# EAGLE design SD (EAGLE 6.4)
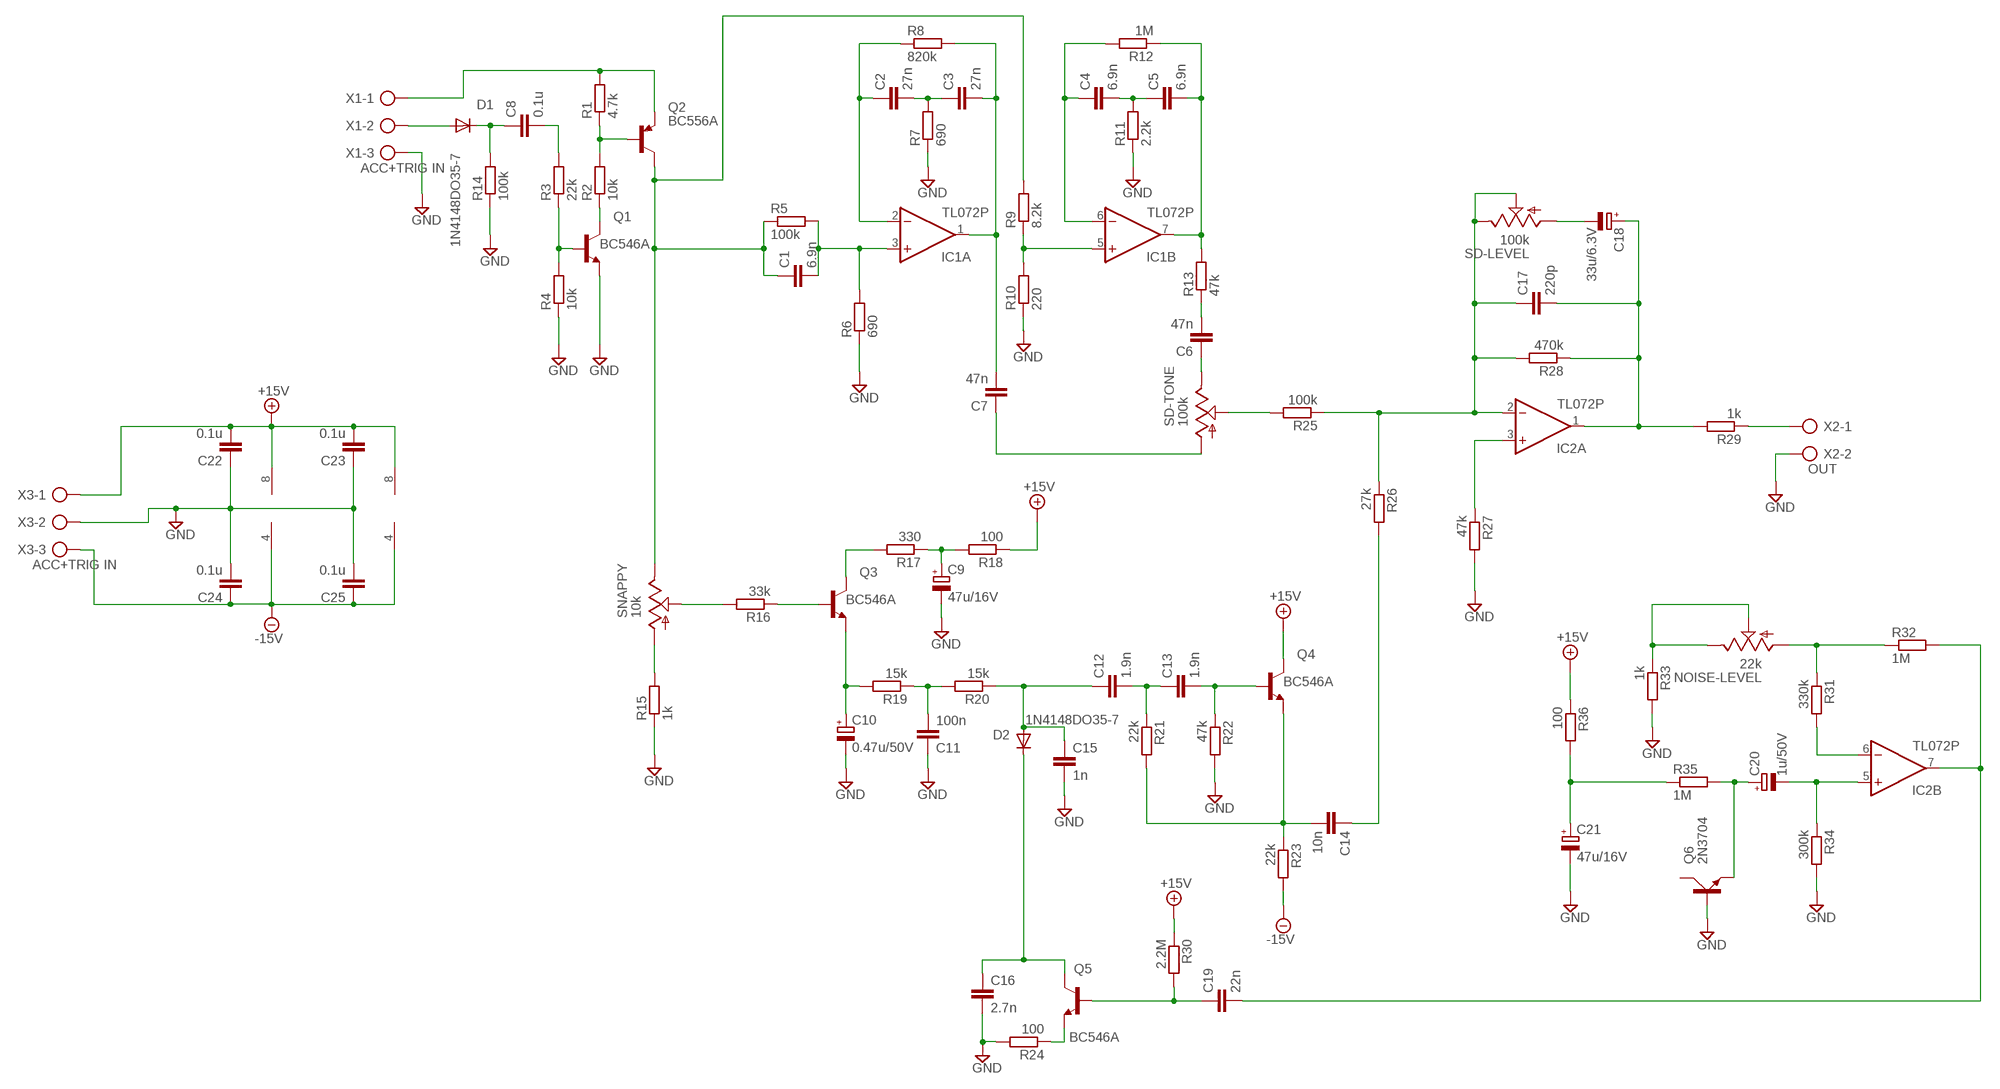
[diagram p0: schematic, sheet 1]

## Parts
C1  6.9n  C-EU075-042X103  [C075-042X103]
C2  27n  C-EU075-042X103  [C075-042X103]
C3  27n  C-EU075-042X103  [C075-042X103]
C4  6.9n  C-EU075-042X103  [C075-042X103]
C5  6.9n  C-EU075-042X103  [C075-042X103]
C6  47n  C-EU075-042X103  [C075-042X103]
C7  47n  C-EU075-042X103  [C075-042X103]
C8  0.1u  C-EU075-042X103  [C075-042X103]
C9  47u/16V  CPOL-EUE2-5  [E2-5]
C10  0.47u/50V  CPOL-EUE2-5  [E2-5]
C11  100n  C-EU075-042X103  [C075-042X103]
C12  1.9n  C-EU075-042X103  [C075-042X103]
C13  1.9n  C-EU075-042X103  [C075-042X103]
C14  10n  C-EU075-042X103  [C075-042X103]
C15  1n  C-EU075-042X103  [C075-042X103]
C16  2.7n  C-EU075-042X103  [C075-042X103]
C17  220p  C-EU075-042X103  [C075-042X103]
C18  33u/6.3V  CPOL-EUE2-5  [E2-5]
C19  22n  C-EU075-042X103  [C075-042X103]
C20  1u/50V  CPOL-EUE2-5  [E2-5]
C21  47u/16V  CPOL-EUE2-5  [E2-5]
C22  0.1u  C-EU075-042X103  [C075-042X103]
C23  0.1u  C-EU075-042X103  [C075-042X103]
C24  0.1u  C-EU075-042X103  [C075-042X103]
C25  0.1u  C-EU075-042X103  [C075-042X103]
D1  1N4148DO35-7  [DO35-7]
D2  1N4148DO35-7  [DO35-7]
IC1  TL072P  [DIL08]
IC2  TL072P  [DIL08]
NOISE-LEVEL  22k  TRIM_US-ECP10P  [ECP10P]
Q1  BC546A  [TO92-EBC]
Q2  BC556A  [TO92-EBC]
Q3  BC546A  [TO92-EBC]
Q4  BC546A  [TO92-EBC]
Q5  BC546A  [TO92-EBC]
Q6  2N3704  [TO92C]
R1  4.7k  R-EU_0207/10  [0207/10]
R2  10k  R-EU_0207/10  [0207/10]
R3  22k  R-EU_0207/10  [0207/10]
R4  10k  R-EU_0207/10  [0207/10]
R5  100k  R-EU_0207/10  [0207/10]
R6  690  R-EU_0207/10  [0207/10]
R7  690  R-EU_0207/10  [0207/10]
R8  820k  R-EU_0207/10  [0207/10]
R9  8.2k  R-EU_0207/10  [0207/10]
R10  220  R-EU_0207/10  [0207/10]
R11  2.2k  R-EU_0207/10  [0207/10]
R12  1M  R-EU_0207/10  [0207/10]
R13  47k  R-EU_0207/10  [0207/10]
R14  100k  R-EU_0207/10  [0207/10]
R15  1k  R-EU_0207/10  [0207/10]
R16  33k  R-EU_0207/10  [0207/10]
R17  330  R-EU_0207/10  [0207/10]
R18  100  R-EU_0207/10  [0207/10]
R19  15k  R-EU_0207/10  [0207/10]
R20  15k  R-EU_0207/10  [0207/10]
R21  22k  R-EU_0207/10  [0207/10]
R22  47k  R-EU_0207/10  [0207/10]
R23  22k  R-EU_0207/10  [0207/10]
R24  100  R-EU_0207/10  [0207/10]
R25  100k  R-EU_0207/10  [0207/10]
R26  27k  R-EU_0207/10  [0207/10]
R27  47k  R-EU_0207/10  [0207/10]
R28  470k  R-EU_0207/10  [0207/10]
R29  1k  R-EU_0207/10  [0207/10]
R30  2.2M  R-EU_0207/10  [0207/10]
R31  330k  R-EU_0207/10  [0207/10]
R32  1M  R-EU_0207/10  [0207/10]
R33  1k  R-EU_0207/10  [0207/10]
R34  300k  R-EU_0207/10  [0207/10]
R35  1M  R-EU_0207/10  [0207/10]
R36  100  R-EU_0207/10  [0207/10]
SD-LEVEL  100k  TRIM_US-ECP10P  [ECP10P]
SD-TONE  100k  TRIM_US-ECP10P  [ECP10P]
SNAPPY  10k  TRIM_US-ECP10P  [ECP10P]
X1  ACC+TRIG IN  AK300/3  [AK300/3]
X2  OUT  AK300/2  [AK300/2]
X3  ACC+TRIG IN  AK300/3  [AK300/3]

## Nets
+15V: C22.2 C23.2 IC1.8(P:V+) IC2.8(P:V+) Q4.C R18.1 R30.1 R36.1 X3.1
-15V: C24.1 C25.1 IC1.4(P:V-) IC2.4(P:V-) R23.2 X3.3
GND: C9.- C10.- C11.1 C15.2 C16.2 C21.- C22.1 C23.1 C24.2 C25.2 Q1.E Q6.B R4.1 R6.1 R7.1 R10.1 R11.1 R14.1 R15.1 R22.2 R24.2 R27.2 R33.2 R34.2 X1.3 X2.2 X3.2
N$1: Q2.E R1.2 X1.1
N$2: Q2.B R1.1 R2.2
N$3: Q1.C R2.1
N$4: C8.2 R3.2
N$5: Q1.B R3.1 R4.2
N$6: C1.2 IC1.3(A:+IN) R5.2 R6.2
N$7: C1.1 Q2.C R5.1 R9.2 SNAPPY.E
N$8: C3.2 C7.2 IC1.1(A:OUT) R8.2
N$9: IC1.5(B:+IN) R9.1 R10.2
N$10: C2.1 IC1.2(A:-IN) R8.1
N$11: C2.2 C3.1 R7.2
N$12: C7.1 SD-TONE.A
N$13: C5.2 IC1.7(B:OUT) R12.1 R13.2
N$14: C4.1 IC1.6(B:-IN) R12.2
N$15: C4.2 C5.1 R11.2
N$16: C6.1 SD-TONE.E
N$17: C6.2 R13.1
N$18: C8.1 D1.C R14.2
N$19: D1.A X1.2
N$20: R15.2 SNAPPY.A
N$21: R16.2 SNAPPY.S
N$22: Q3.B R16.1
N$23: Q3.C R17.2
N$24: C9.+ R17.1 R18.2
N$25: C10.+ Q3.E R19.2
N$26: C11.2 R19.1 R20.2
N$27: C13.2 Q4.B R22.1
N$28: C12.2 C13.1 R21.1
N$29: C12.1 C15.1 D2.A R20.1
N$30: C14.2 Q4.E R21.2 R23.1
N$31: C16.1 D2.C Q5.C
N$32: R25.2 SD-TONE.S
N$33: Q5.E R24.1
N$34: C14.1 R26.2
N$35: C17.1 IC2.2(A:-IN) R25.1 R26.1 R28.2 SD-LEVEL.E SD-LEVEL.S
N$36: IC2.3(A:+IN) R27.1
N$37: R29.1 X2.1
N$38: C19.1 Q5.B R30.2
N$39: C18.- SD-LEVEL.A
N$40: C17.2 C18.+ IC2.1(A:OUT) R28.1 R29.2
N$41: C19.2 IC2.7(B:OUT) R32.2
N$42: NOISE-LEVEL.A R31.1 R32.1
N$43: IC2.6(B:-IN) R31.2
N$44: NOISE-LEVEL.E NOISE-LEVEL.S R33.1
N$45: C20.- IC2.5(B:+IN) R34.1
N$46: C20.+ Q6.E R35.2
N$47: C21.+ R35.1 R36.2
Unconnected: Q6.C

## Library data of the parts
C1-C8 C11-C17 C19 C22-C25 = rcl:C-EU: CAPACITOR, European symbol
C9 C10 C18 C20 C21 = rcl:CPOL-EU: POLARIZED CAPACITOR, European symbol
D1 D2 = diode:1N4148: DIODE high speed (Philips)
IC1 IC2 = linear:TL072: OP AMP
NOISE-LEVEL SD-LEVEL SD-TONE SNAPPY = pot:TRIM_US-: POTENTIOMETER
Q1 Q3-Q5 = transistor-npn:BC546*: NPN Transistor
Q2 = transistor-pnp:BC556*: PNP Transistror
Q6 = transistor-small-signal:2N3704: NPN TRANSISTOR
R1-R36 = rcl:R-EU_: RESISTOR, European symbol
X1 X3 = con-ptr500:AK300/3: CONNECTOR; OC_FARNELL: unknown; OC_NEWARK: unknown
X2 = con-ptr500:AK300/2: CONNECTOR; OC_FARNELL: unknown; OC_NEWARK: unknown

## Board
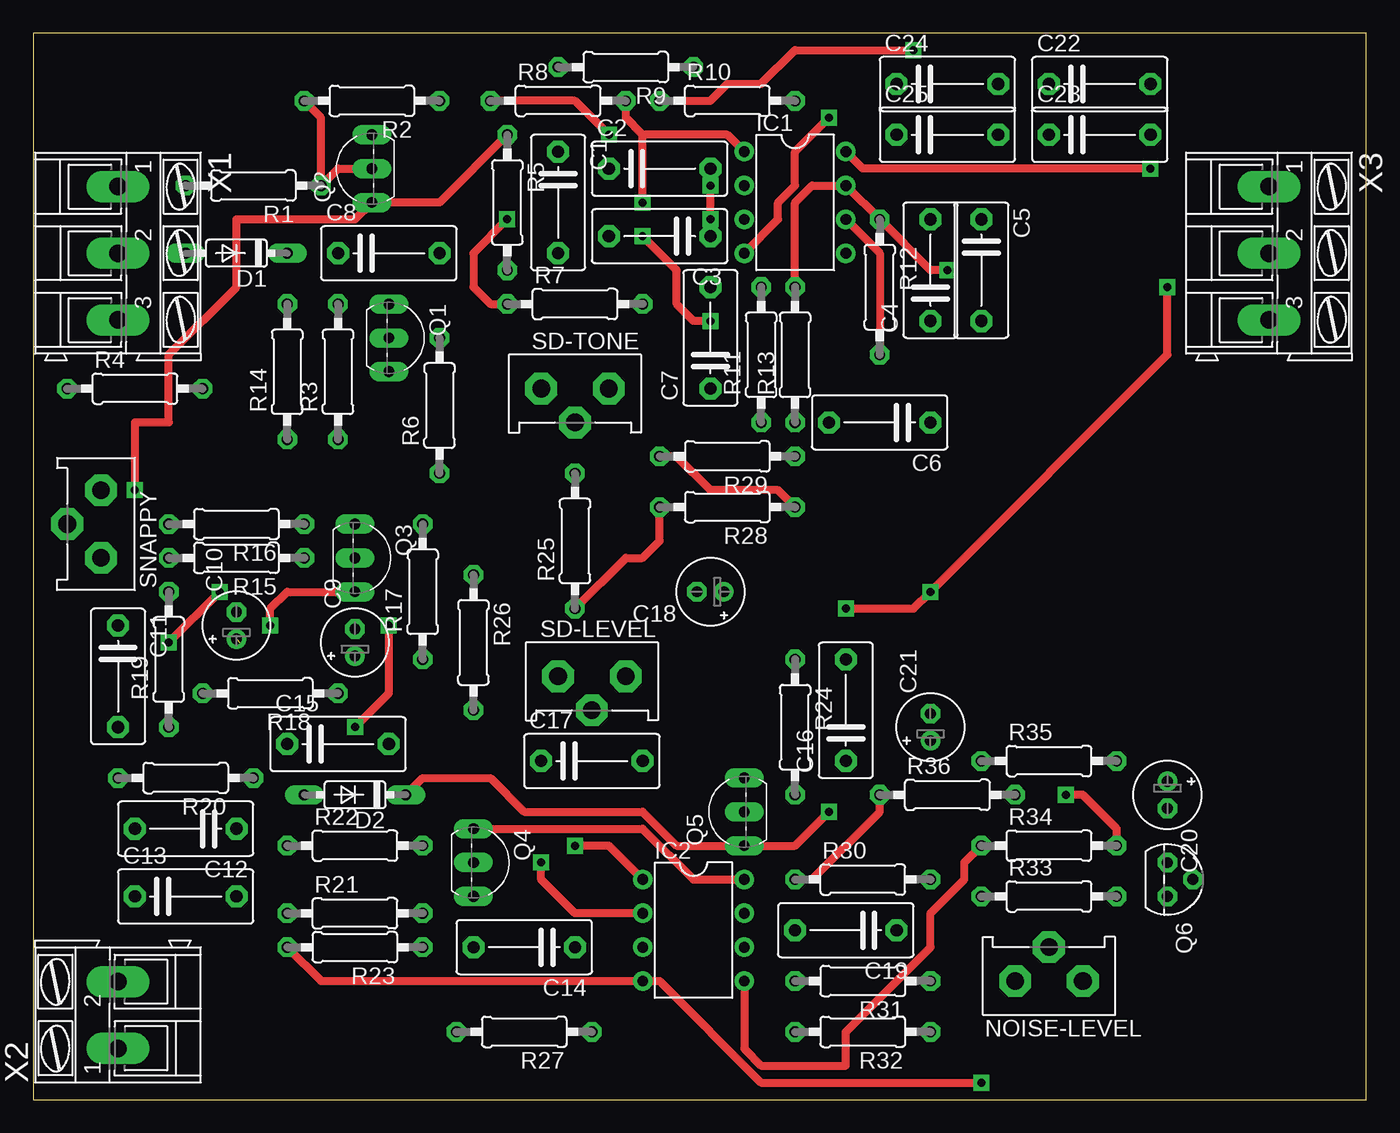
[diagram p1: board, top side]
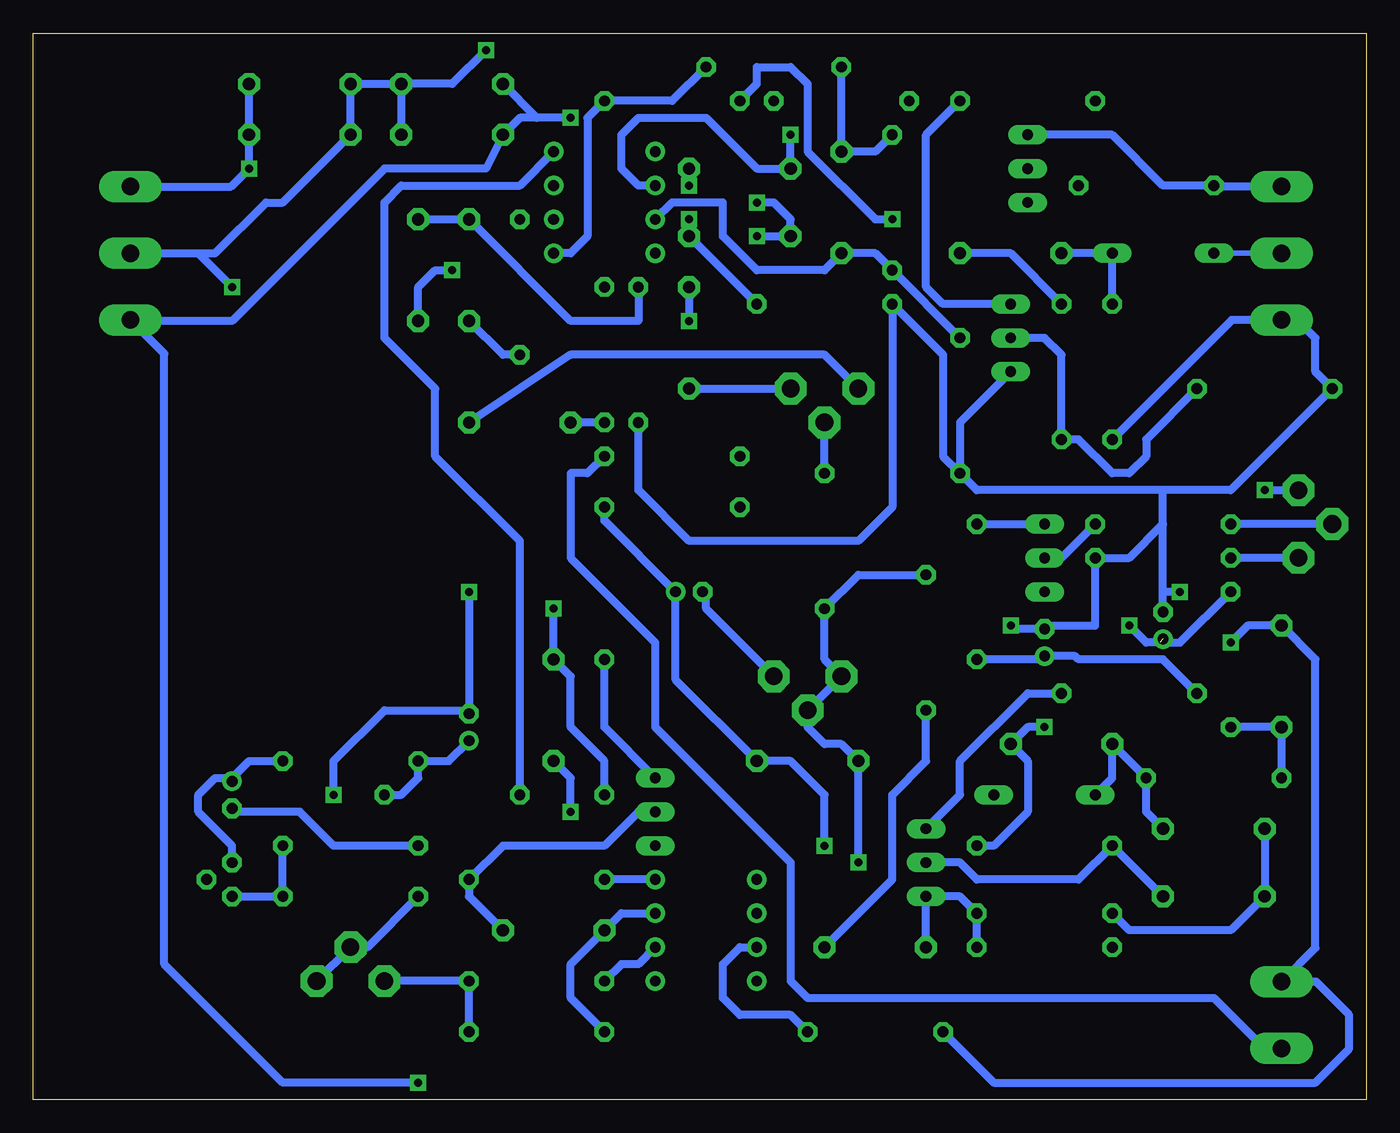
[diagram p2: board, bottom side, seen from below]

Size 100 x 80 mm. Coordinates in mm from the lower left corner, seen from the top.
Outline: 0,0 100,0 100,80 0,80 0,0
Copper layers (1*16): Top 0.035mm / dielectric 1.5mm / Bottom 0.035mm
Design rules "default *": minimum track width 10mil, minimum drill 24mil, track to track 8mil, track to pad 8mil, pad to pad 8mil, via to via 8mil, smd to smd 8mil, copper to edge 40mil, drill to drill 8mil, minimum pad ring 10mil, minimum via ring 8mil, stop-mask expansion 4mil, vias tented up to drill 0mil, thermal gap 10mil

### Footprints (pad centres in the part's own frame; a part is rotated, then mirrored left to right if it is on the bottom)
C075-042X103 = drill 0.914 octagon: 1 -3.81,0; 2 3.81,0
E2-5 = drill 0.813 pad 1.27: + -1.016,0 | drill 0.813 pad 1.27 octagon: - 1.016,0
DO35-7 = drill 0.813 long: A 3.81,0; C -3.81,0
DIL08 = drill 0.813 pad 1.27: 1 -3.81,-3.81; 2 -1.27,-3.81; 3 1.27,-3.81; 4 3.81,-3.81; 5 3.81,3.81; 6 1.27,3.81; 7 -1.27,3.81; 8 -3.81,3.81
ECP10P = drill 1.321 octagon: A -2.54,0; E 2.54,0; S 0,2.54
TO92-EBC = drill 0.813 long: B 0,-1.27; C -2.54,-1.27; E 2.54,-1.27
TO92C = drill 0.813 octagon: B 1.27,0; C 0,1.905; E -1.27,0
0207/10 = drill 0.813 octagon: 1 -5.08,0; 2 5.08,0
AK300/3 = drill 1.321 long: 1 -5.004,0; 2 0,0; 3 5.004,0
AK300/2 = drill 1.321 long: 1 -2.515,0; 2 2.489,0

### Placement (x,y rotation side)
C1  39.37,67.31 270 top
C2  46.99,69.85 0 top
C3  46.99,64.77 180 top
C4  67.31,62.23 90 top
C5  71.12,62.23 270 top
C6  63.5,50.8 180 top
C7  50.8,57.15 90 top
C8  26.67,63.5 0 top
C9  24.13,34.29 90 top
C10  15.24,35.56 90 top
C11  6.35,31.75 270 top
C12  11.43,20.32 180 top
C13  11.43,15.24 0 top
C14  36.83,11.43 180 top
C15  22.86,26.67 0 top
C16  60.96,29.21 90 top
C17  41.91,25.4 0 top
C18  50.8,38.1 180 top
C19  60.96,12.7 180 top
C20  85.09,22.86 270 top
C21  67.31,27.94 90 top
C22  80.01,76.2 0 top
C23  80.01,72.39 0 top
C24  68.58,76.2 0 top
C25  68.58,72.39 0 top
D1  15.24,63.5 180 top
D2  24.13,22.86 180 top
IC1  57.15,67.31 270 top
IC2  49.53,12.7 270 top
NOISE-LEVEL  76.2,8.89 0 top
Q1  27.94,57.15 270 top
Q2  24.13,69.85 90 top
Q3  25.4,40.64 270 top
Q4  34.29,17.78 270 top
Q5  52.07,21.59 90 top
Q6  85.09,16.51 270 top
R1  16.51,68.58 180 top
R2  25.4,74.93 180 top
R3  22.86,54.61 90 top
R4  7.62,53.34 0 top
R5  35.56,67.31 270 top
R6  30.48,52.07 90 top
R7  40.64,59.69 0 top
R8  39.37,74.93 0 top
R9  44.45,77.47 180 top
R10  52.07,74.93 0 top
R11  54.61,55.88 90 top
R12  63.5,60.96 270 top
R13  57.15,55.88 90 top
R14  19.05,54.61 90 top
R15  15.24,40.64 180 top
R16  15.24,43.18 180 top
R17  29.21,38.1 90 top
R18  17.78,30.48 180 top
R19  10.16,33.02 90 top
R20  11.43,24.13 180 top
R21  24.13,13.97 0 top
R22  24.13,19.05 0 top
R23  24.13,11.43 180 top
R24  57.15,27.94 270 top
R25  40.64,41.91 90 top
R26  33.02,34.29 270 top
R27  36.83,5.08 180 top
R28  52.07,44.45 180 top
R29  52.07,48.26 180 top
R30  62.23,16.51 0 top
R31  62.23,8.89 180 top
R32  62.23,5.08 180 top
R33  76.2,15.24 0 top
R34  76.2,19.05 0 top
R35  76.2,25.4 0 top
R36  68.58,22.86 0 top
SD-LEVEL  41.91,31.75 180 top
SD-TONE  40.64,53.34 180 top
SNAPPY  5.08,43.18 90 top
X1  6.35,63.5 270 top
X2  6.35,6.35 90 top
X3  92.71,63.5 270 top

### Tracks (layer width: path | path; a pad name or v marks a point on that pad's centre or on a via)
+15V  (via drill 0.6)
  Top 0.61: Q4.C 45.72,20.32 49.53,16.51 IC2.8 | R30.1 58.42,16.51 63.5,21.59 R36.1 | v83.82,69.85 62.23,69.85 IC1.8
  Bottom 0.61: Q4.C 30.48,22.86 30.48,25.4 25.4,30.48 R18.1 | IC2.8 R30.1 | R36.1 63.5,41.91 69.85,48.26 69.85,53.34 73.66,57.15 73.66,67.31 72.39,68.58 63.5,68.58 IC1.8 | X3.1 85.17,68.5 v83.82,69.85 C23.2 C22.2
-15V  (via drill 0.6)
  Top 0.61: R23.2 21.59,8.89 IC2.4 46.99,8.89 54.61,1.27 v71.12,1.27 | IC1.4 55.88,66.04 55.88,67.31 57.15,68.58 57.15,71.12 v59.69,73.66
  Bottom 0.61: v59.69,73.66 62.23,73.66 | 62.23,73.66 C24.1 | 62.23,73.66 63.5,73.66 C25.1 66.04,69.85 73.66,69.85 85.09,58.42 92.63,58.42 X3.3 90.17,55.96 90.17,10.16 81.28,1.27 v71.12,1.27
GND  (via drill 0.6)
  Top 0.61: v35.56,66.04 33.02,63.5 33.02,60.96 34.29,59.69 R7.1 | R10.1 50.8,74.93 52.07,76.2 54.61,76.2 57.15,78.74 v66.04,78.74 | R34.2 81.28,20.32 78.74,22.86 v77.47,22.86 | v85.09,60.96 85.09,55.88 v67.31,38.1 66.04,36.83 v60.96,36.83 | v10.16,34.29 v13.97,38.1 | v26.67,35.56 26.67,30.48 v24.13,27.94
  Bottom 0.61: X1.3 10.08,58.5 R14.1 | 6.35,58.42 X1.3 | X1.3 5.16,58.5 3.81,57.15 3.81,54.61 R4.1 10.16,45.72 15.24,45.72 | Q1.E 30.48,50.8 R6.1 | 15.24,45.72 29.21,45.72 R6.1 | R6.1 31.75,48.26 31.75,55.88 R7.1 35.56,44.45 38.1,41.91 50.8,41.91 54.61,45.72 R11.1 | R10.1 45.72,76.2 45.72,77.47 43.18,77.47 41.91,76.2 41.91,71.12 36.83,66.04 v35.56,66.04 | 15.24,43.18 17.78,40.64 R15.1 20.32,35.56 23.88,35.56 C9.- 26.42,35.31 v26.67,35.56 | 15.24,43.18 15.24,45.72 | C10.- 15.24,38.1 | 15.24,38.1 15.24,43.18 | R22.2 27.94,19.05 25.4,21.59 25.4,25.4 C15.2 25.4,27.94 v24.13,27.94 | R27.2 27.94,1.27 3.81,1.27 1.27,3.81 1.27,6.35 3.76,8.84 X2.2 3.81,11.38 3.81,33.02 C11.1 8.89,35.56 v10.16,34.29 | Q6.B R33.2 R34.2 | R24.2 57.15,25.4 59.69,27.94 59.69,31.75 C16.2 v60.96,36.83 | X3.2 87.63,63.5 | 87.63,63.5 86.36,63.5 82.55,67.31 81.28,67.31 C23.1 C22.1 C24.2 | C24.2 C25.2 | v66.04,78.74 68.58,76.2 C24.2 | v85.09,60.96 87.63,63.5 | v13.97,38.1 15.24,38.1 | v67.31,38.1 C21.- 67.56,29.21 73.66,29.21 77.47,25.4 v77.47,22.86
N$1
  Bottom 0.61: X1.1 11.35,68.5 R1.2 15.24,68.58 19.05,72.39 Q2.E
N$2
  Top 0.61: R2.2 21.59,73.66 R1.1 22.86,69.85 Q2.B
N$3
  Bottom 0.61: Q1.C 31.75,59.69 33.02,60.96 33.02,72.39 R2.1
N$4
  Bottom 0.61: R3.2 26.67,63.5 C8.2
N$5
  Bottom 0.61: Q1.B 24.13,57.15 22.86,55.88 R3.1 21.59,49.53 19.05,46.99 17.78,46.99 16.51,48.26 16.51,49.53 R4.2
N$6
  Bottom 0.61: R6.2 R5.2 36.83,63.5 C1.2 40.64,62.23 45.72,62.23 48.26,64.77 48.26,67.31 52.07,67.31 IC1.3
N$7  (via drill 0.6)
  Top 0.61: R5.1 30.48,67.31 Q2.C 24.13,66.04 15.24,66.04 15.24,60.96 10.16,55.88 10.16,50.8 7.62,50.8 v7.62,45.72
  Bottom 0.61: R5.1 36.83,71.12 C1.1 R9.2 | v7.62,45.72 SNAPPY.E
N$8  (via drill 0.6)
  Top 0.61: 45.72,72.39 44.45,73.66 R8.2 | IC1.1 52.07,72.39 45.72,72.39 | v50.8,58.42 49.53,58.42 48.26,59.69 48.26,62.23 v45.72,64.77 | v45.72,67.31 45.72,72.39
  Bottom 0.61: C7.2 v50.8,58.42 | v45.72,64.77 C3.2 43.18,66.04 44.45,67.31 v45.72,67.31
N$9
  Bottom 0.61: R9.1 52.07,74.93 R10.2 58.42,73.66 58.42,64.77 59.69,63.5 IC1.5
N$10  (via drill 0.6)
  Top 0.61: v43.18,72.39 40.64,74.93 R8.1
  Bottom 0.61: IC1.2 54.61,68.58 55.88,69.85 55.88,72.39 54.61,73.66 49.53,73.66 45.72,69.85 C2.1 v43.18,72.39
N$11  (via drill 0.6)
  Top 0.61: v50.8,66.04 v50.8,68.58
  Bottom 0.61: R7.2 C3.1 v50.8,66.04 | v50.8,68.58 C2.2
N$12
  Bottom 0.61: C7.1 SD-TONE.A
N$13  (via drill 0.6)
  Top 0.61: R13.2 57.15,67.31 58.42,68.58 IC1.7 R12.1 67.31,62.23 v68.58,62.23
  Bottom 0.61: C5.2 71.12,60.96 69.85,62.23 v68.58,62.23
N$14
  Top 0.61: IC1.6 63.5,63.5 R12.2
  Bottom 0.61: R12.2 64.77,55.88 C4.1
N$15
  Bottom 0.61: R11.2 54.61,58.42 59.69,58.42 C4.2 C5.1
N$16
  Bottom 0.61: SD-TONE.E 40.64,55.88 59.69,55.88 C6.1
N$17
  Bottom 0.61: R13.1 C6.2
N$18
  Bottom 0.61: R14.2 D1.C C8.1
N$19
  Bottom 0.406: D1.A X1.2
N$20
  Bottom 0.61: SNAPPY.A R15.2
N$21
  Bottom 0.61: SNAPPY.S R16.2
N$22
  Bottom 0.61: R16.1 22.86,40.64 Q3.B
N$23
  Bottom 0.61: R17.2 Q3.C
N$24
  Bottom 0.61: R18.2 15.24,33.02 21.59,33.02 21.84,33.27 C9.+ 24.38,33.02 R17.1
N$25  (via drill 0.6)  (1 unrouted)
  Top 0.61: v17.78,35.56 17.78,36.83 19.05,38.1 Q3.E
  Bottom 0.61: C10.+ 14.99,34.29 13.97,34.29 R19.2 | 15.49,34.29 16.51,34.29 v17.78,35.56
N$26
  Bottom 0.61: R20.2 C11.2 R19.1
N$27
  Bottom 0.61: C13.2 R22.1 21.59,16.51 29.21,16.51 30.48,17.78 Q4.B
N$28
  Bottom 0.61: C12.2 C13.1 10.16,12.7 17.78,12.7 R21.1
N$29
  Bottom 0.61: C12.1 16.51,21.59 R20.1 C15.1 19.05,24.13 D2.A
N$30
  Bottom 0.61: R23.1 R21.2 30.48,15.24 Q4.E C14.2
N$31  (via drill 0.6)
  Top 0.61: D2.C 29.21,24.13 34.29,24.13 36.83,21.59 45.72,21.59 48.26,19.05 Q5.C 57.15,19.05 v59.69,21.59
  Bottom 0.61: v59.69,21.59 59.69,24.13 C16.1
N$32
  Bottom 0.61: R25.2 SD-TONE.S
N$33
  Bottom 0.61: Q5.E 57.15,27.94 R24.1
N$34
  Bottom 0.61: C14.1 35.56,16.51 35.56,22.86 33.02,25.4 R26.2
N$35  (via drill 0.6)
  Top 0.61: R25.1 44.45,40.64 45.72,40.64 46.99,41.91 R28.2 | IC2.2 40.64,13.97 38.1,16.51 v38.1,17.78
  Bottom 0.61: R26.1 38.1,39.37 R25.1 40.64,33.02 SD-LEVEL.E SD-LEVEL.S 41.91,27.94 40.64,26.67 39.37,26.67 C17.1 v38.1,17.78
N$36
  Bottom 0.61: R27.1 43.18,6.35 46.99,6.35 48.26,7.62 48.26,10.16 46.99,11.43 IC2.3
N$37
  Bottom 0.61: R29.1 58.42,46.99 59.69,46.99 59.69,40.64 53.34,34.29 53.34,27.94 43.18,17.78 43.18,8.89 41.91,7.62 11.43,7.62 7.62,3.81 6.35,3.81 X2.1
N$38
  Bottom 0.61: Q5.B 54.61,21.59 57.15,19.05 64.77,19.05 R30.2 67.31,15.24 C19.1
N$39
  Bottom 0.61: SD-LEVEL.A 49.53,36.83 49.53,38.1 C18.-
N$40  (via drill 0.6)
  Top 0.61: R28.1 55.88,45.72 50.8,45.72 48.26,48.26 R29.2 | IC2.1 43.18,19.05 v40.64,19.05
  Bottom 0.61: R28.1 57.15,43.43 C18.+ 51.82,31.5 C17.2 43.18,25.4 40.64,22.86 v40.64,19.05
N$41
  Bottom 0.61: R32.2 59.69,7.62 59.69,10.16 C19.2 55.88,13.97 IC2.7
N$42
  Bottom 0.61: R32.1 R31.1 NOISE-LEVEL.A
N$43
  Bottom 0.61: IC2.6 54.61,10.16 55.88,10.16 R31.2
N$44
  Bottom 0.61: NOISE-LEVEL.E NOISE-LEVEL.S 74.93,11.43 R33.1
N$45
  Top 0.61: IC2.5 53.34,3.81 54.61,2.54 60.96,2.54 60.96,5.08 67.31,11.43 67.31,13.97 69.85,16.51 69.85,17.78 R34.1
  Bottom 0.61: R34.1 77.47,19.05 80.01,21.59 84.84,21.59 C20.-
N$46
  Bottom 0.61: Q6.E 85.09,19.05 87.63,21.59 87.63,22.86 86.36,24.13 85.34,24.13 C20.+ 85.09,24.13 83.82,25.4 R35.2
N$47
  Bottom 0.61: R36.2 72.39,22.86 71.12,24.13 R35.1 68.83,25.4 C21.+